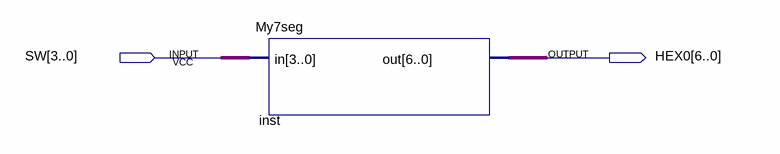
[diagram p0: schematic sheet]
// Quartus schematic ex1_top.bdf as structural Verilog: 1 symbols, 2 pins
module ex1_top (
  input  [3:0] SW,
  output [6:0] HEX0
);

  My7seg inst (.in(SW), .out(HEX0));
endmodule
